# EAGLE design FitNibble_v2 (EAGLE 8.3.2)
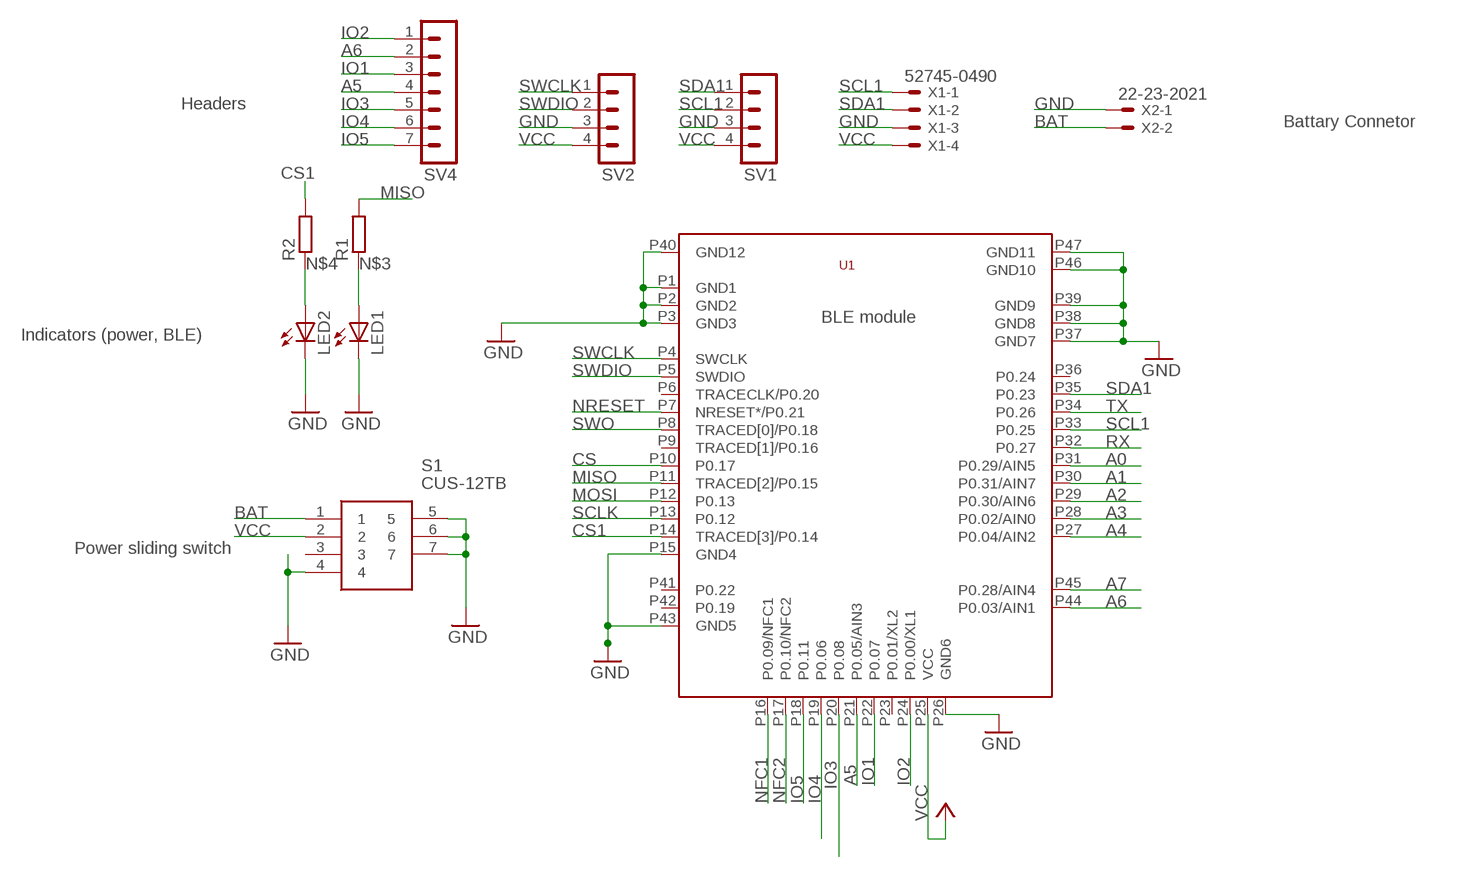
[diagram p0: schematic, sheet 1]

## Parts
LED1  LED_ESML0603  [LED_SML0603]
LED2  LED_ESML0603  [LED_SML0603]
R1  R-EU_R0603  [R0603]
R2  R-EU_R0603  [R0603]
S1  CUS-12TB  [CUS-12B]
SV1  MA04-1  [MA04-1]
SV2  MA04-1  [MA04-1]
SV4  MA07-1  [MA07-1]
U1  BMD-350  [BMD-350]
X1  52745-0490  [52745-0490]
X2  22-23-2021  [22-23-2021]

## Nets
A0: U1.P31(P0.29/AIN5)
A1: U1.P30(P0.31/AIN7)
A2: U1.P29(P0.30/AIN6)
A3: U1.P28(P0.02/AIN0)
A4: U1.P27(P0.04/AIN2)
A5: SV4.4 U1.P21(P0.05/AIN3)
A6: SV4.2 U1.P44(P0.03/AIN1)
A7: U1.P45(P0.28/AIN4)
BAT: S1.1 X2.2
CS: U1.P10(P0.17)
CS1: R2.2 U1.P14(TRACED[3]/P0.14)
GND: LED1.C LED2.C S1.4 S1.5 S1.6 S1.7 SV1.3 SV2.3 U1.P1(GND1) U1.P2(GND2) U1.P3(GND3) U1.P15(GND4) U1.P26(GND6) U1.P37(GND7) U1.P38(GND8) U1.P39(GND9) U1.P40(GND12) U1.P43(GND5) U1.P46(GND10) U1.P47(GND11) X1.3 X2.1
IO1: SV4.3 U1.P22(P0.07)
IO2: SV4.1 U1.P24(P0.00/XL1)
IO3: SV4.5 U1.P20(P0.08)
IO4: SV4.6 U1.P19(P0.06)
IO5: SV4.7 U1.P18(P0.11)
MISO: R1.2 U1.P11(TRACED[2]/P0.15)
MOSI: U1.P12(P0.13)
N$3: LED1.A R1.1
N$4: LED2.A R2.1
NFC1: U1.P16(P0.09/NFC1)
NFC2: U1.P17(P0.10/NFC2)
NRESET: U1.P7(NRESET*/P0.21)
RX: U1.P32(P0.27)
SCL1: SV1.2 U1.P33(P0.25) X1.1
SCLK: U1.P13(P0.12)
SDA1: SV1.1 U1.P35(P0.23) X1.2
SWCLK: SV2.1 U1.P4(SWCLK)
SWDIO: SV2.2 U1.P5(SWDIO)
SWO: U1.P8(TRACED[0]/P0.18)
TX: U1.P34(P0.26)
VCC: S1.2 SV1.4 SV2.4 U1.P25(VCC) X1.4
Unconnected: S1.3 U1.P6(TRACECLK/P0.20) U1.P9(TRACED[1]/P0.16) U1.P23(P0.01/XL2) U1.P36(P0.24) U1.P41(P0.22) U1.P42(P0.19)

## Notes on the sheet
- Headers
- Battary Connetor
- BLE module
- Indicators (power, BLE)
- Power sliding switch

## Library data of the parts
LED1 LED2 = eagle-ltspice:LED_E: LED Source: http://www.osram.convergy.de Source: www.luxeon.com Source: www.kingbright.com; SPICEMODEL: NONE; SPICEPREFIX: D; SPICETYPE: diode
R1 R2 = rcl:R-EU_: RESISTOR, European symbol
S1 = CUS-12TB:CUS-12TB: LOW-PROFILE SLIDE SWITCHES Source: Datasheet <http://www.nidec-copal-electronics.com/e/catalog/switch/cus.pdf>; ARROW_PART_NUMBER: CUS-12TB; DESCRIPTION: LOW-PROFILE SLIDE SWITCHES; HEIGHT: mm; MANUFACTURER_NAME: Copal Electronics; MANUFACTURER_PART_NUMBER: CUS-12TB
SV1 SV2 = con-lstb:MA04-1: PIN HEADER; OC_FARNELL: unknown; OC_NEWARK: unknown
SV4 = con-lstb:MA07-1: PIN HEADER; OC_FARNELL: unknown; OC_NEWARK: unknown
U1 = BMD-350-Eagle:BMD-350
X1 = con-molex:52745-0490: FFC/FPC-to-Board 0.50mm (.020") SMT Top Contact Right Angle, ZIF, Style Receptacle 52745 / 52435 Source: http://www.molex.com/product/ffc/52745.html; MPN: 52745-0490; OC_FARNELL: unknown; OC_NEWARK: 61H4699
X2 = con-molex:22-23-2021: .100" (2.54mm) Center Header - 2 Pin; MF: MOLEX; MPN: 22-23-2021; OC_FARNELL: 1462926; OC_NEWARK: 25C3832

## Board
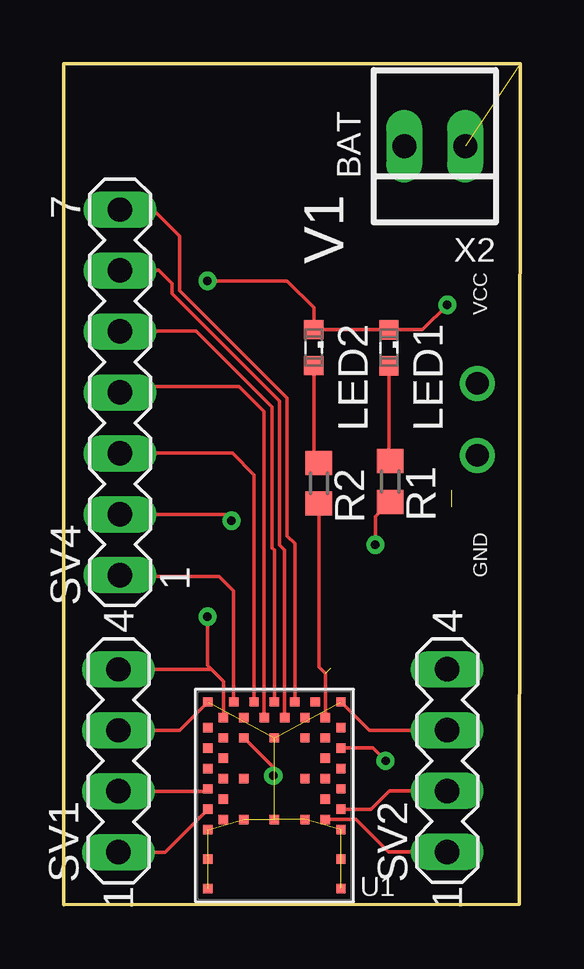
[diagram p1: board, top side]
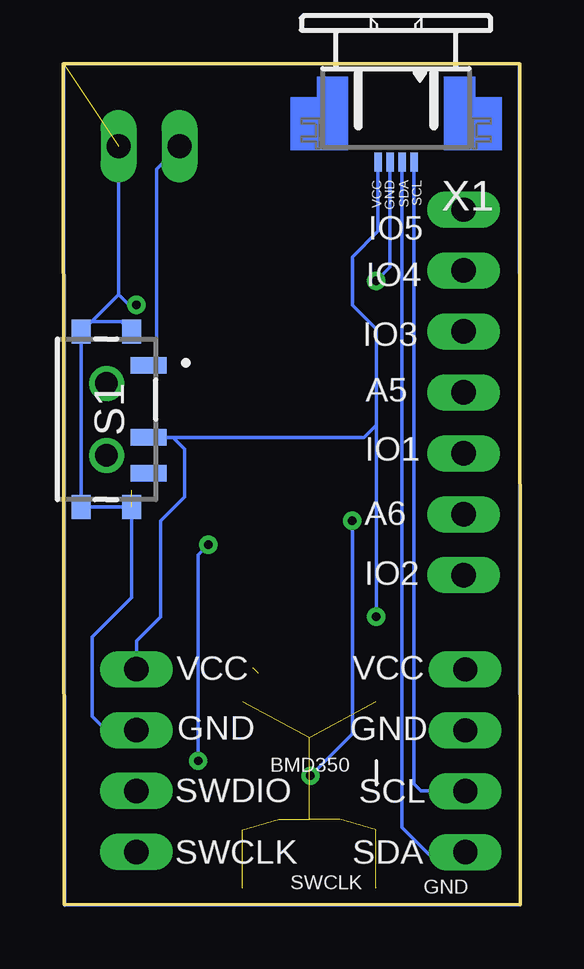
[diagram p2: board, bottom side, seen from below]

Size 19.05 x 35.06 mm. Coordinates in mm from the lower left corner, seen from the top.
Outline: 0,0 0.01,35.06 19.05,35.05 19,0.02 0,0
Copper layers (1*16): Top 0.035mm / dielectric 1.5mm / Bottom 0.035mm
Design rules "default": minimum track width 6mil, minimum drill 0.35mm, track to track 6mil, track to pad 6mil, pad to pad 6mil, via to via 6mil, smd to smd 6mil, copper to edge 40mil, drill to drill 6mil, minimum pad ring 10mil, minimum via ring 8mil, stop-mask expansion 4mil, vias tented up to drill 0mil, thermal gap 10mil

### Footprints (pad centres in the part's own frame; a part is rotated, then mirrored left to right if it is on the bottom)
LED_SML0603 = smd 0.8 x 0.8: A 0.75,0; C -0.75,0
R0603 = smd 1 x 1.1: 1 -0.85,0; 2 0.85,0
CUS-12B = smd 0.7 x 1.5: 1 -2.25,1.75; 2 0.75,1.75; 3 2.25,1.75 | smd 1 x 0.8: 4 3.65,1.05; 5 3.65,-1.05; 6 -3.65,-1.05; 7 -3.65,1.05 | drill 0.95 pad 1.45: 8 -1.5,0; 9 1.5,0
MA04-1 = drill 1.016 long: 1 -3.81,0; 2 -1.27,0; 3 1.27,0; 4 3.81,0
MA07-1 = drill 1.016 long: 1 -7.62,0; 2 -5.08,0; 3 -2.54,0; 4 0,0; 5 2.54,0; 6 5.08,0; 7 7.62,0
BMD-350 = smd 0.39 x 0.39: P1 0.425,8.2; P2 0.425,6.975; P3 0.425,5.75; P4 1.075,5.325; P5 0.425,4.9; P6 1.075,4.475; P7 0.425,4.05; P8 1.075,3.625; P9 0.425,3.2; P10 1.075,2.775; P11 0.425,2.35; P12 1.075,1.925; P13 0.425,1.5; P14 1.075,1.075; P15 0.425,0.425; P16 1.5,0.425; P17 1.925,1.075; P18 2.35,0.425; P19 2.775,1.075; P20 3.2,0.425; P21 3.625,1.075; P22 4.05,0.425; P23 4.475,1.075; P24 4.9,0.425; P25 5.325,1.075; P26 5.975,0.425; P27 5.975,1.5; P28 5.325,1.925; P29 5.975,2.35; P30 5.325,2.775; P31 5.975,3.2; P32 5.325,3.625; P33 5.975,4.05; P34 5.325,4.475; P35 5.975,4.9; P36 5.325,5.325; P37 5.975,5.75; P38 5.975,6.975; P39 5.975,8.2; P40 1.925,5.325; P41 1.925,3.625; P42 1.925,1.925; P43 3.2,1.925; P44 4.475,1.925; P45 4.475,3.625; P46 4.475,5.325; P47 3.2,5.325
52745-0490 = smd 0.3 x 0.8: 1 -0.75,2.5; 2 -0.25,2.5; 3 0.25,2.5; 4 0.75,2.5
22-23-2021 = drill 1 long: 1 -1.27,0; 2 1.27,0

### Placement (x,y rotation side)
LED1  13.56,23.21 270 top
LED2  10.43,23.22 270 top
R1  13.62,17.64 270 top
R2  10.65,17.56 270 top
S1  17.25,20.23 270 bottom
SV1  2.29,5.99 90 top
SV2  16,6 90 top
SV4  2.35,21.35 90 top
U1  11.99,8.87 180 top
X1  5.17,33.45 180 bottom
X2  15.48,31.61 180 top

### Tracks (layer width: path | path; a pad name or v marks a point on that pad's centre or on a via)
A5
  Top 0.152: U1.P21 8.37,20.55 7.32,21.6 2.6,21.6 SV4.4
A6  (via drill 0.35)
  Top 0.152: SV4.2 6.73,16.27 v7,16 | v8.74,5.37 8.74,5.72 U1.P44
  Bottom 0.152: v7,16 7,7.12 v8.74,5.37
BAT
  Bottom 0.152: S1.1 15.16,22.82 15.16,30.66 X2.2
CS1  (1 unrouted)
  Top 0.152: U1.P14 10.92,9.63 10.65,9.91 R2.2
GND  (via drill 0.35)  (13 unrouted)
  Top 0.152: SV1.3 4.83,7.26 U1.P26 | SV2.3 12.74,7.27 U1.P15 | v16,25 14.96,23.96 LED1.C LED2.C 10.44,23.98 10.44,24.88 9.33,26 v6,26
  Bottom 0.152: 16.75,25.43 X2.1 | 17.87,24.31 16.75,25.43 | 17.87,24.31 16.63,24.31 S1.7 | SV2.3 16.27,7 17,7 17.85,7.85 17.85,11.15 16.2,12.8 S1.4 S1.5 S1.6 17.87,24.31 | v16,25 16.31,25 16.75,25.43 | X1.3 5.42,26.58 v6,26 | 0.03,35.06 19.04,35.05 18.99,-0.03 0,0 0.03,35.06
IO1
  Top 0.152: U1.P22 7.94,17.91 7.04,18.81 SV4.3
IO2
  Top 0.152: U1.P24 7.09,13.08 6.49,13.68 2.4,13.68 SV4.1
IO3
  Top 0.152: U1.P20 8.79,14.78 8.7,14.87 8.7,20.74 5.53,23.9 2.36,23.9 SV4.5
IO4
  Top 0.152: U1.P19 9.22,14.78 9,15 9,21 4.53,25.47 4.53,25.89 3.96,26.45 2.38,26.45 SV4.6
IO5
  Top 0.152: U1.P18 9.64,15.05 9.31,15.38 9.31,21.12 4.83,25.6 4.83,27.86 3.77,28.92 2.4,28.92 SV4.7
MISO  (via drill 0.35)
  Top 0.152: U1.P11 12.89,6.52 v13.43,5.99 | R1.2 13,16.17 v13,15
  Bottom 0.152: v13.43,5.99 13.43,14.57 v13,15
N$3
  Top 0.152: LED1.A 13.56,18.55 R1.1
N$4
  Top 0.152: LED2.A 10.43,18.63 R2.1
NRESET
  Top 0.152: U1.P7 11.67,4.82
SCL1
  Top 0.152: SV1.2 5.92,4.72 U1.P33
  Bottom 0.152: X1.1 4.42,5.02 4.14,4.74 2.3,4.74 SV1.2
SDA1
  Top 0.152: SV1.1 4.23,2.18 U1.P35
  Bottom 0.152: X1.2 4.92,3.21 3.81,2.1 2.37,2.1 SV1.1
SWCLK
  Top 0.152: U1.P4 11.86,3.55 12.2,3.55 13.55,2.19 SV2.1
SWDIO
  Top 0.152: SV2.2 13.58,4.73 12.82,3.97 U1.P5
TX
  Top 0.152: U1.P34
VCC  (via drill 0.35)
  Top 0.152: 6.17,9.8 SV1.4 | 6.17,9.8 6.67,9.3 U1.P25 | v6,12 6,9.97 6.17,9.8
  Bottom 0.152: SV1.4 | SV2.4 16,11 15,12 15,16 14,17 14,19 14.48,19.48 S1.2 6.52,19.48 6,20 | 5.92,12.08 v6,12 6,20 | X1.4 5.92,28.08 7,27 7,25 6,24 6,20

### Text on the board
tNames: BAT | V1 | VCC | GND
bNames: SCL | SDA | GND | VCC | IO5 | IO4 | IO3 | A5 | IO1 | A6 | IO2 | VCC | VCC | GND | GND | BMD350 | SCL | SWDIO | SDA | SWCLK | SWCLK | GND